# Altium schematic sheet Sheet3.SchDoc
size 381 x 355 mm; SheetNumber: 1; SheetTotal: 1; SPICEModelCacheLTXYMWKK: <root> / <DocumentId>LTXYMWKK</DocumentId> / </root>
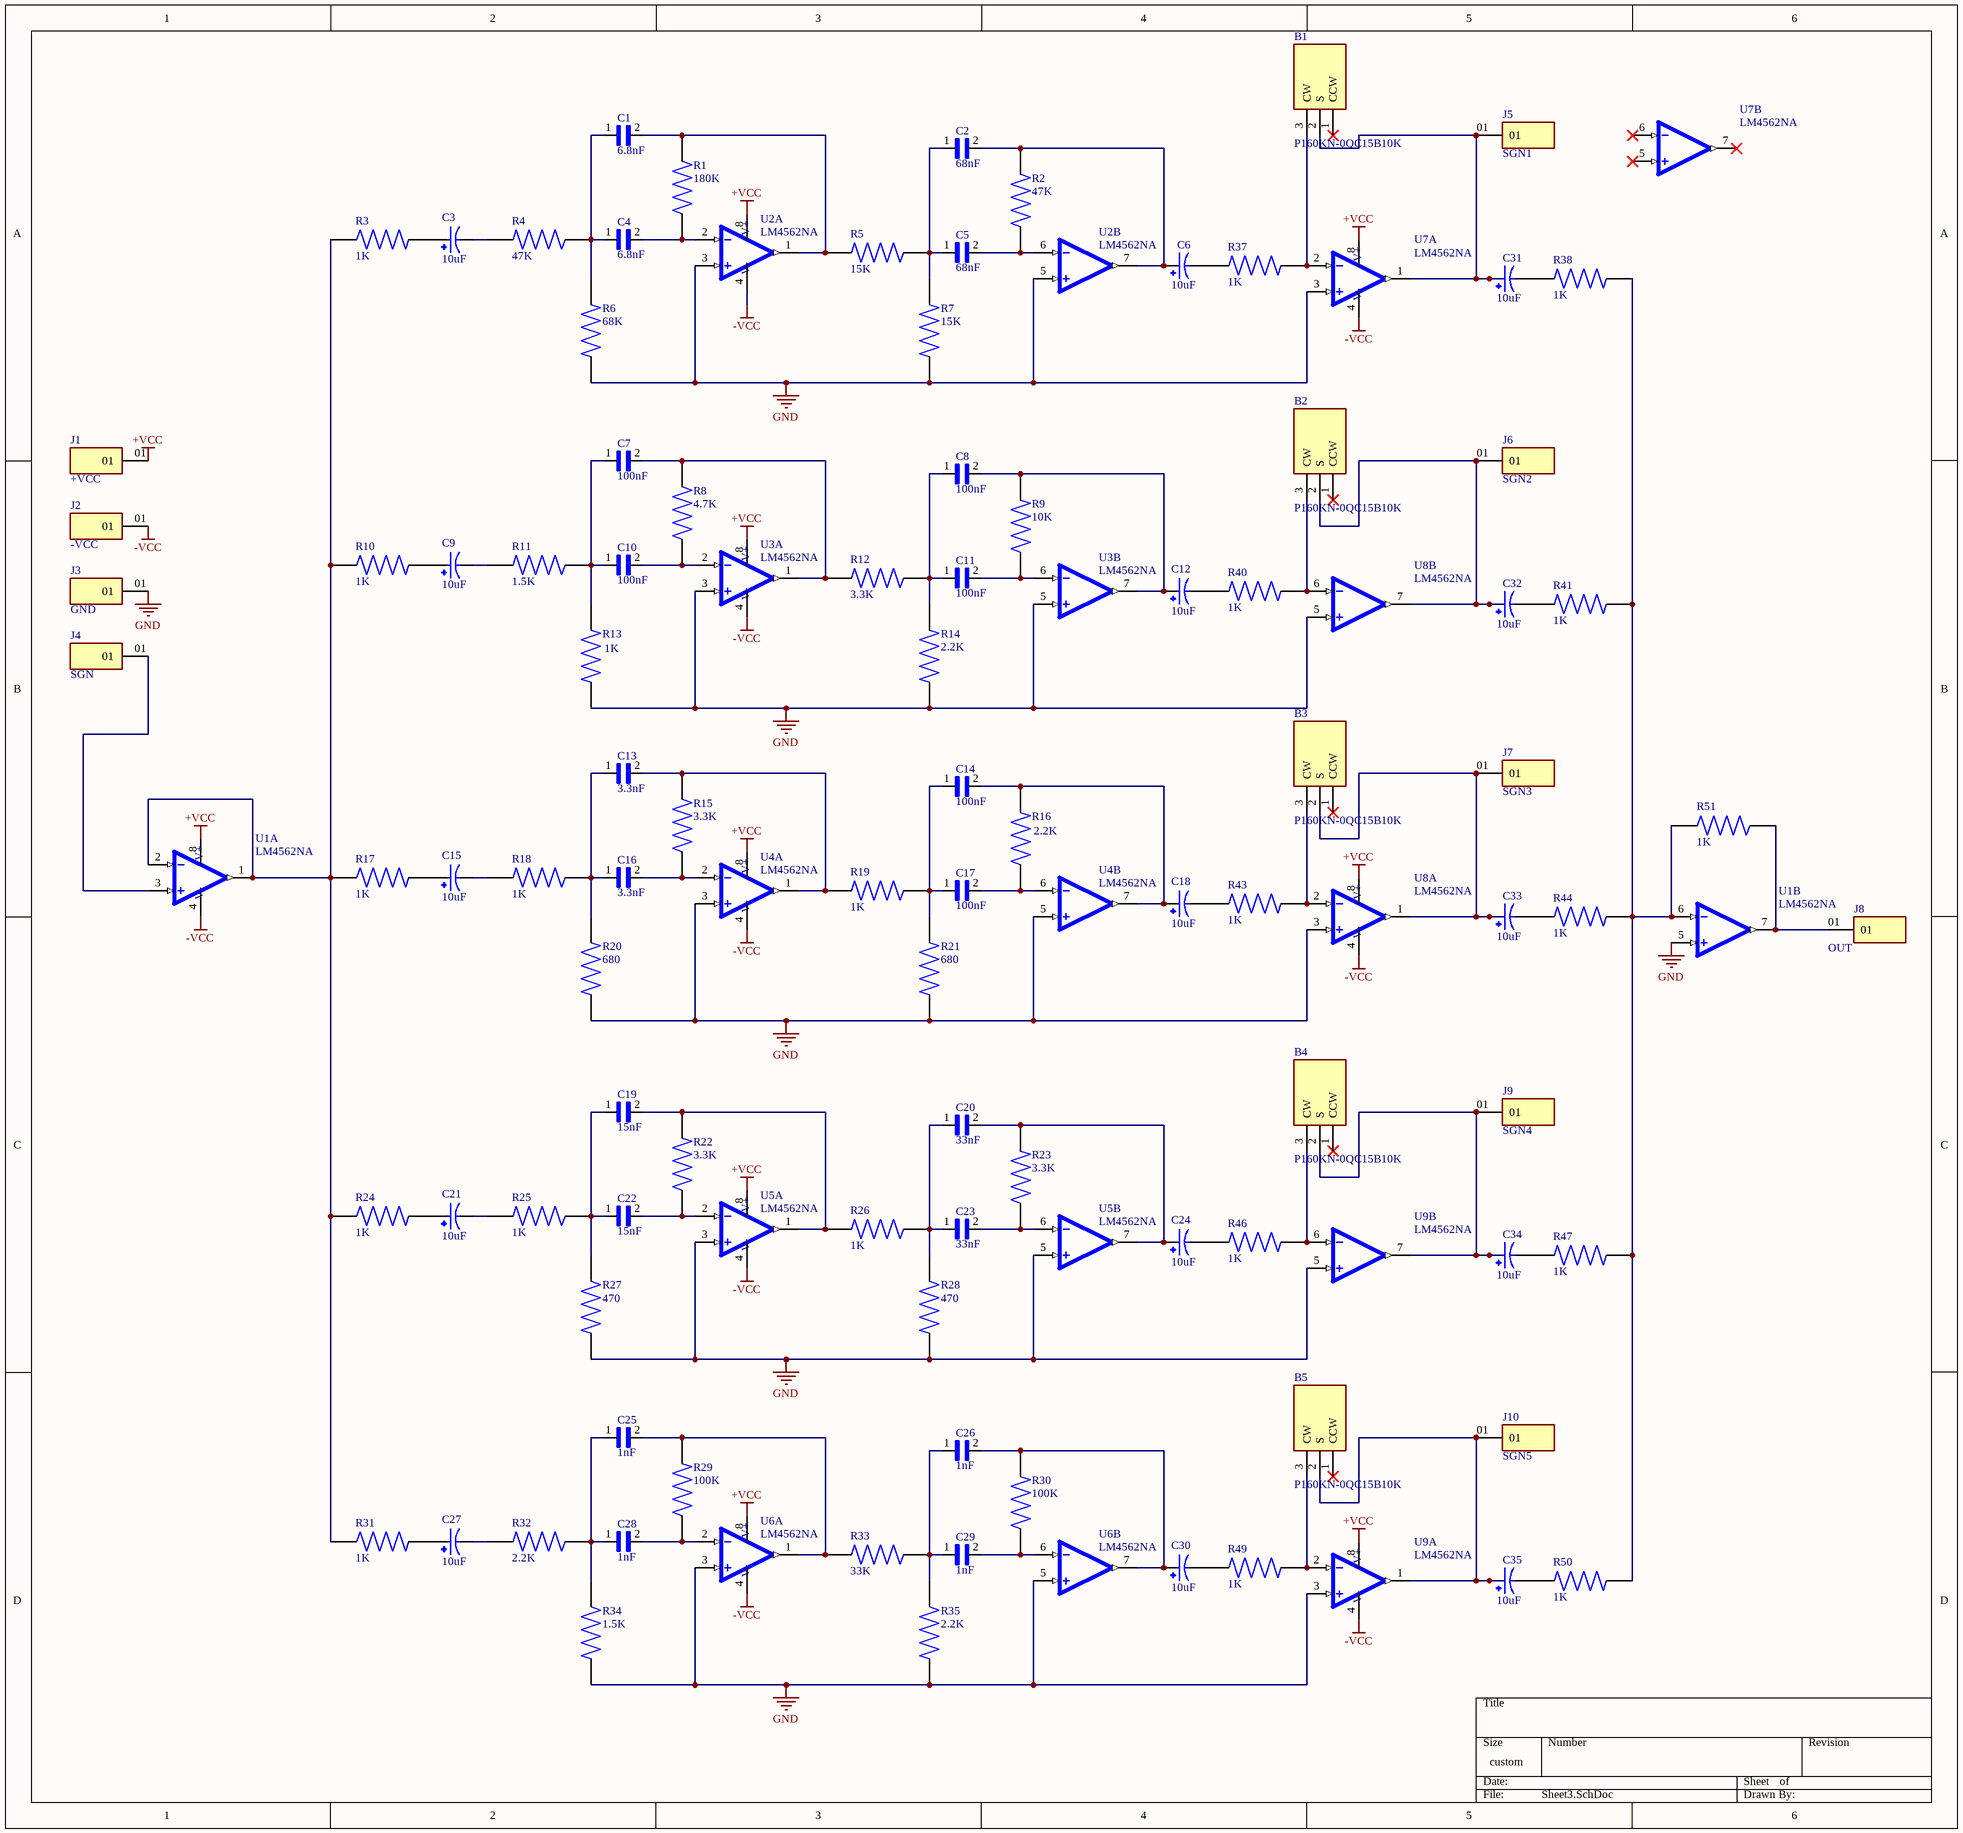
[diagram p0: Sheet3.SchDoc]

## Parts
B1  P160KN-0QC15B10K  [P160KN0QC15B10K]
B2  P160KN-0QC15B10K  [P160KN0QC15B10K]
B3  P160KN-0QC15B10K  [P160KN0QC15B10K]
B4  P160KN-0QC15B10K  [P160KN0QC15B10K]
B5  P160KN-0QC15B10K  [P160KN0QC15B10K]
C1  6.8nF  [CAPRB500W50L550T350H600]
C2  68nF  [CAPRB500W50L550T350H600]
C3  10uF  [CAPPRD500W60D1250H2000]
C4  6.8nF  [CAPRB500W50L550T350H600]
C5  68nF  [CAPRB500W50L550T350H600]
C6  10uF  [CAPPRD500W60D1250H2000]
C7  100nF  [CAPRB500W50L550T350H600]
C8  100nF  [CAPRB500W50L550T350H600]
C9  10uF  [CAPPRD500W60D1250H2000]
C10  100nF  [CAPRB500W50L550T350H600]
C11  100nF  [CAPRB500W50L550T350H600]
C12  10uF  [CAPPRD500W60D1250H2000]
C13  3.3nF  [CAPRB500W50L550T350H600]
C14  100nF  [CAPRB500W50L550T350H600]
C15  10uF  [CAPPRD500W60D1250H2000]
C16  3.3nF  [CAPRB500W50L550T350H600]
C17  100nF  [CAPRB500W50L550T350H600]
C18  10uF  [CAPPRD500W60D1250H2000]
C19  15nF  [CAPRB500W50L550T350H600]
C20  33nF  [CAPRB500W50L550T350H600]
C21  10uF  [CAPPRD500W60D1250H2000]
C22  15nF  [CAPRB500W50L550T350H600]
C23  33nF  [CAPRB500W50L550T350H600]
C24  10uF  [CAPPRD500W60D1250H2000]
C25  1nF  [CAPRB500W50L550T350H600]
C26  1nF  [CAPRB500W50L550T350H600]
C27  10uF  [CAPPRD500W60D1250H2000]
C28  1nF  [CAPRB500W50L550T350H600]
C29  1nF  [CAPRB500W50L550T350H600]
C30  10uF  [CAPPRD500W60D1250H2000]
C31  10uF  [CAPPRD500W60D1250H2000]
C32  10uF  [CAPPRD500W60D1250H2000]
C33  10uF  [CAPPRD500W60D1250H2000]
C34  10uF  [CAPPRD500W60D1250H2000]
C35  10uF  [CAPPRD500W60D1250H2000]
J1  +VCC  [SAMTEC_MTMM-101-XX-X-S-XXX]
J2  -VCC  [SAMTEC_MTMM-101-XX-X-S-XXX]
J3  GND  [SAMTEC_MTMM-101-XX-X-S-XXX]
J4  SGN  [SAMTEC_MTMM-101-XX-X-S-XXX]
J5  SGN1  [SAMTEC_MTMM-101-XX-X-S-XXX]
J6  SGN2  [SAMTEC_MTMM-101-XX-X-S-XXX]
J7  SGN3  [SAMTEC_MTMM-101-XX-X-S-XXX]
J8  OUT  [SAMTEC_MTMM-101-XX-X-S-XXX]
J9  SGN4  [SAMTEC_MTMM-101-XX-X-S-XXX]
J10  SGN5  [SAMTEC_MTMM-101-XX-X-S-XXX]
R1  180K  [RESAD1100W55L680D260]
R2  47K  [RESAD1100W55L680D260]
R3  1K  [RESAD1100W55L680D260]
R4  47K  [RESAD1100W55L680D260]
R5  15K  [RESAD1100W55L680D260]
R6  68K  [RESAD1100W55L680D260]
R7  15K  [RESAD1100W55L680D260]
R8  4.7K  [RESAD1100W55L680D260]
R9  10K  [RESAD1100W55L680D260]
R10  1K  [RESAD1100W55L680D260]
R11  1.5K  [RESAD1100W55L680D260]
R12  3.3K  [RESAD1100W55L680D260]
R13  1K  [RESAD1100W55L680D260]
R14  2.2K  [RESAD1100W55L680D260]
R15  3.3K  [RESAD1100W55L680D260]
R16  2.2K  [RESAD1100W55L680D260]
R17  1K  [RESAD1100W55L680D260]
R18  1K  [RESAD1100W55L680D260]
R19  1K  [RESAD1100W55L680D260]
R20  680  [RESAD1100W55L680D260]
R21  680  [RESAD1100W55L680D260]
R22  3.3K  [RESAD1100W55L680D260]
R23  3.3K  [RESAD1100W55L680D260]
R24  1K  [RESAD1100W55L680D260]
R25  1K  [RESAD1100W55L680D260]
R26  1K  [RESAD1100W55L680D260]
R27  470  [RESAD1100W55L680D260]
R28  470  [RESAD1100W55L680D260]
R29  100K  [RESAD1100W55L680D260]
R30  100K  [RESAD1100W55L680D260]
R31  1K  [RESAD1100W55L680D260]
R32  2.2K  [RESAD1100W55L680D260]
R33  33K  [RESAD1100W55L680D260]
R34  1.5K  [RESAD1100W55L680D260]
R35  2.2K  [RESAD1100W55L680D260]
R37  1K  [RESAD1100W55L680D260]
R38  1K  [RESAD1100W55L680D260]
R40  1K  [RESAD1100W55L680D260]
R41  1K  [RESAD1100W55L680D260]
R43  1K  [RESAD1100W55L680D260]
R44  1K  [RESAD1100W55L680D260]
R46  1K  [RESAD1100W55L680D260]
R47  1K  [RESAD1100W55L680D260]
R49  1K  [RESAD1100W55L680D260]
R50  1K  [RESAD1100W55L680D260]
R51  1K  [RESAD1100W55L680D260]
U1  LM4562NA  [DIP794W45P254L959H508Q8]  (parts A,B of 2)
U2  LM4562NA  [DIP794W45P254L959H508Q8]  (parts A,B of 2)
U3  LM4562NA  [DIP794W45P254L959H508Q8]  (parts A,B of 2)
U4  LM4562NA  [DIP794W45P254L959H508Q8]  (parts A,B of 2)
U5  LM4562NA  [DIP794W45P254L959H508Q8]  (parts A,B of 2)
U6  LM4562NA  [DIP794W45P254L959H508Q8]  (parts A,B of 2)
U7  LM4562NA  [DIP794W45P254L959H508Q8]  (parts A,B of 2)
U8  LM4562NA  [DIP794W45P254L959H508Q8]  (parts A,B of 2)
U9  LM4562NA  [DIP794W45P254L959H508Q8]  (parts A,B of 2)

## Nets
+VCC: J1.01 U1.8(V+) U2.8(V+) U3.8(V+) U4.8(V+) U5.8(V+) U6.8(V+) U7.8(V+) U8.8(V+) U9.8(V+)
-VCC: J2.01 U1.4(V-) U2.4(V-) U3.4(V-) U4.4(V-) U5.4(V-) U6.4(V-) U7.4(V-) U8.4(V-) U9.4(V-)
GND: J3.01 R6.1 R7.1 R13.1 R14.1 R20.1 R21.1 R27.1 R28.1 R34.1 R35.1 U1.5(INB+) U2.3(INA+) U2.5(INB+) U3.3(INA+) U3.5(INB+) U4.3(INA+) U4.5(INB+) U5.3(INA+) U5.5(INB+) U6.3(INA+) U6.5(INB+) U7.3(INA+) U8.3(INA+) U8.5(INB+) U9.3(INA+) U9.5(INB+)
NetB1_2: B1.2(S) C31.P J5.01 U7.1(OUTA)
NetB1_3: B1.3(CW) R37.1 U7.2(INA-)
NetB2_2: B2.2(S) C32.P J6.01 U8.7(OUTB)
NetB2_3: B2.3(CW) R40.1 U8.6(INB-)
NetB3_2: B3.2(S) C33.P J7.01 U8.1(OUTA)
NetB3_3: B3.3(CW) R43.1 U8.2(INA-)
NetB4_2: B4.2(S) C34.P J9.01 U9.7(OUTB)
NetB4_3: B4.3(CW) R46.1 U9.6(INB-)
NetB5_2: B5.2(S) C35.P J10.01 U9.1(OUTA)
NetB5_3: B5.3(CW) R49.1 U9.2(INA-)
NetC1_1: C1.1 C4.1 R4.2 R6.2
NetC1_2: C1.2 R1.2 R5.2 U2.1(OUTA)
NetC2_1: C2.1 C5.1 R5.1 R7.2
NetC2_2: C2.2 C6.P R2.2 U2.7(OUTB)
NetC3_N: C3.N R4.1
NetC3_P: C3.P R3.2
NetC4_2: C4.2 R1.1 U2.2(INA-)
NetC5_2: C5.2 R2.1 U2.6(INB-)
NetC6_N: C6.N R37.2
NetC7_1: C7.1 C10.1 R11.2 R13.2
NetC7_2: C7.2 R8.2 R12.2 U3.1(OUTA)
NetC8_1: C8.1 C11.1 R12.1 R14.2
NetC8_2: C8.2 C12.P R9.2 U3.7(OUTB)
NetC9_N: C9.N R11.1
NetC9_P: C9.P R10.2
NetC10_2: C10.2 R8.1 U3.2(INA-)
NetC11_2: C11.2 R9.1 U3.6(INB-)
NetC12_N: C12.N R40.2
NetC13_1: C13.1 C16.1 R18.2 R20.2
NetC13_2: C13.2 R15.2 R19.2 U4.1(OUTA)
NetC14_1: C14.1 C17.1 R19.1 R21.2
NetC14_2: C14.2 C18.P R16.2 U4.7(OUTB)
NetC15_N: C15.N R18.1
NetC15_P: C15.P R17.2
NetC16_2: C16.2 R15.1 U4.2(INA-)
NetC17_2: C17.2 R16.1 U4.6(INB-)
NetC18_N: C18.N R43.2
NetC19_1: C19.1 C22.1 R25.2 R27.2
NetC19_2: C19.2 R22.2 R26.2 U5.1(OUTA)
NetC20_1: C20.1 C23.1 R26.1 R28.2
NetC20_2: C20.2 C24.P R23.2 U5.7(OUTB)
NetC21_N: C21.N R25.1
NetC21_P: C21.P R24.2
NetC22_2: C22.2 R22.1 U5.2(INA-)
NetC23_2: C23.2 R23.1 U5.6(INB-)
NetC24_N: C24.N R46.2
NetC25_1: C25.1 C28.1 R32.2 R34.2
NetC25_2: C25.2 R29.2 R33.2 U6.1(OUTA)
NetC26_1: C26.1 C29.1 R33.1 R35.2
NetC26_2: C26.2 C30.P R30.2 U6.7(OUTB)
NetC27_N: C27.N R32.1
NetC27_P: C27.P R31.2
NetC28_2: C28.2 R29.1 U6.2(INA-)
NetC29_2: C29.2 R30.1 U6.6(INB-)
NetC30_N: C30.N R49.2
NetC31_N: C31.N R38.2
NetC32_N: C32.N R41.2
NetC33_N: C33.N R44.2
NetC34_N: C34.N R47.2
NetC35_N: C35.N R50.2
NetJ4_01: J4.01 U1.3(INA+)
NetJ8_01: J8.01 R51.1 U1.7(OUTB)
NetR3_1: R3.1 R10.1 R17.1 R24.1 R31.1 U1.1(OUTA) U1.2(INA-)
NetR38_1: R38.1 R41.1 R44.1 R47.1 R50.1 R51.2 U1.6(INB-)

Not connected (* = marked no-connect by the designer): B1 1(CCW)*; B2 1(CCW)*; B3 1(CCW)*; B4 1(CCW)*; B5 1(CCW)*; U7 5(INB+)* 6(INB-)* 7(OUTB)*

## Library data of the parts
B1-B5 = P160KN-0QC15B10K: Potentiometers 16mm Rotary Panel Potentiometer; Manufacturer_Name: TT Electronics; Geometry.Height: 16.5mm; Manufacturer_Part_Number: P160KN-0QC15B10K; Mouser Part Number: 858-P160KN-0QC15B10K; Mouser Price/Stock: https://www.mouser.co.uk/ProductDetail/BI-Technologies-TT-Electronics/P160KN-0QC15B10K?qs=%252BUYXD5bnyXowj%252Bd8P32cNw%3D%3D; Arrow Part Number: P160KN-0QC15B10K; Arrow Price/Stock: https://www.arrow.com/en/products/p160kn-0qc15b10k/bi-technologies; Mouser Testing Part Number: *; Mouser Testing Price/Stock: *; Datasheet Link: https://datasheet.datasheetarchive.com/originals/distributors/Datasheets-DGA21/91824.pdf
C1 C2 C4 C5 C7 C8 C10 C11 C13 C14 C16 C17 C19 C20 C22 C23 C25 C26 C28 C29 = FG26X7R2E104KNT06: 0.1ÂµF Â±10% 250V Ceramic Capacitor X7R Radial; MF: TDK; Purchase-URL: https://pricing.snapeda.com/search/part/FG26X7R2E104KNT06/?ref=eda; Package: Radial TDK; Availability: In Stock; Value: *; MP: FG26X7R2E104KNT06; Check_prices: https://www.snapeda.com/parts/FG26X7R2E104KNT06/TDK/view-part/?ref=eda; Price: None; SnapEDA_Link: https://www.snapeda.com/parts/FG26X7R2E104KNT06/TDK/view-part/?ref=snap
C3 C6 C9 C12 C15 C18 C21 C24 C27 C30-C35 = ECA2WM100B: CAP ALUM 10UF 20% 450V RADIAL; MP: ECA-2WM100B; MF: Panasonic; Availability: In Stock; Check_prices: https://www.snapeda.com/parts/ECA-2WM100B/Panasonic/view-part/2313535/?ref=eda; SnapEDA_Link: https://www.snapeda.com/parts/ECA-2WM100B/Panasonic/view-part/2313535/?ref=snap; Value: *; Price: None; Purchase-URL: https://pricing.snapeda.com/search/part/ECA-2WM100B/?ref=eda; Package: RADIAL-2 Panasonic
J1-J10 = MTMM-101-XX-X-S-XXX: Connector Header position; Package: None; MP: MTMM-101-XX-X-S-XXX; Value: *; Availability: Unavailable; Price: None
R1-R35 R37 R38 R40 R41 R43 R44 R46 R47 R49-R51 = MFR-25FBF52-1K: 1.78 kOhms Â±1% 0.25W, 1/4W Through Hole Resistor Axial - Metal Film; MF: Yageo; Package: Axial Yageo; Check_prices: https://www.snapeda.com/parts/MFR-25FBF52-1K/Yageo/view-part/?ref=eda; Availability: In Stock; MP: MFR-25FBF52-1K; Value: *; Purchase-URL: https://pricing.snapeda.com/search/part/MFR-25FBF52-1K/?ref=eda; Price: None; SnapEDA_Link: https://www.snapeda.com/parts/MFR-25FBF52-1K/Yageo/view-part/?ref=snap
U1-U9 = LM4562NA: LM4562 2 - Dual Channels per IC Audio Amplifier Evaluation Board; MF: Texas Instruments; Check_prices: https://www.snapeda.com/parts/LM4562NA/Texas+Instruments/view-part/?ref=eda; Value: *; Availability: In Stock; MP: LM4562NA; Price: None; Package: DIP-8 Texas Instruments; SnapEDA_Link: https://www.snapeda.com/parts/LM4562NA/Texas+Instruments/view-part/?ref=snap; Purchase-URL: https://pricing.snapeda.com/search/part/LM4562NA/?ref=eda